# EAGLE design pcb-pick-plaz-feeder (EAGLE 9.6.2)
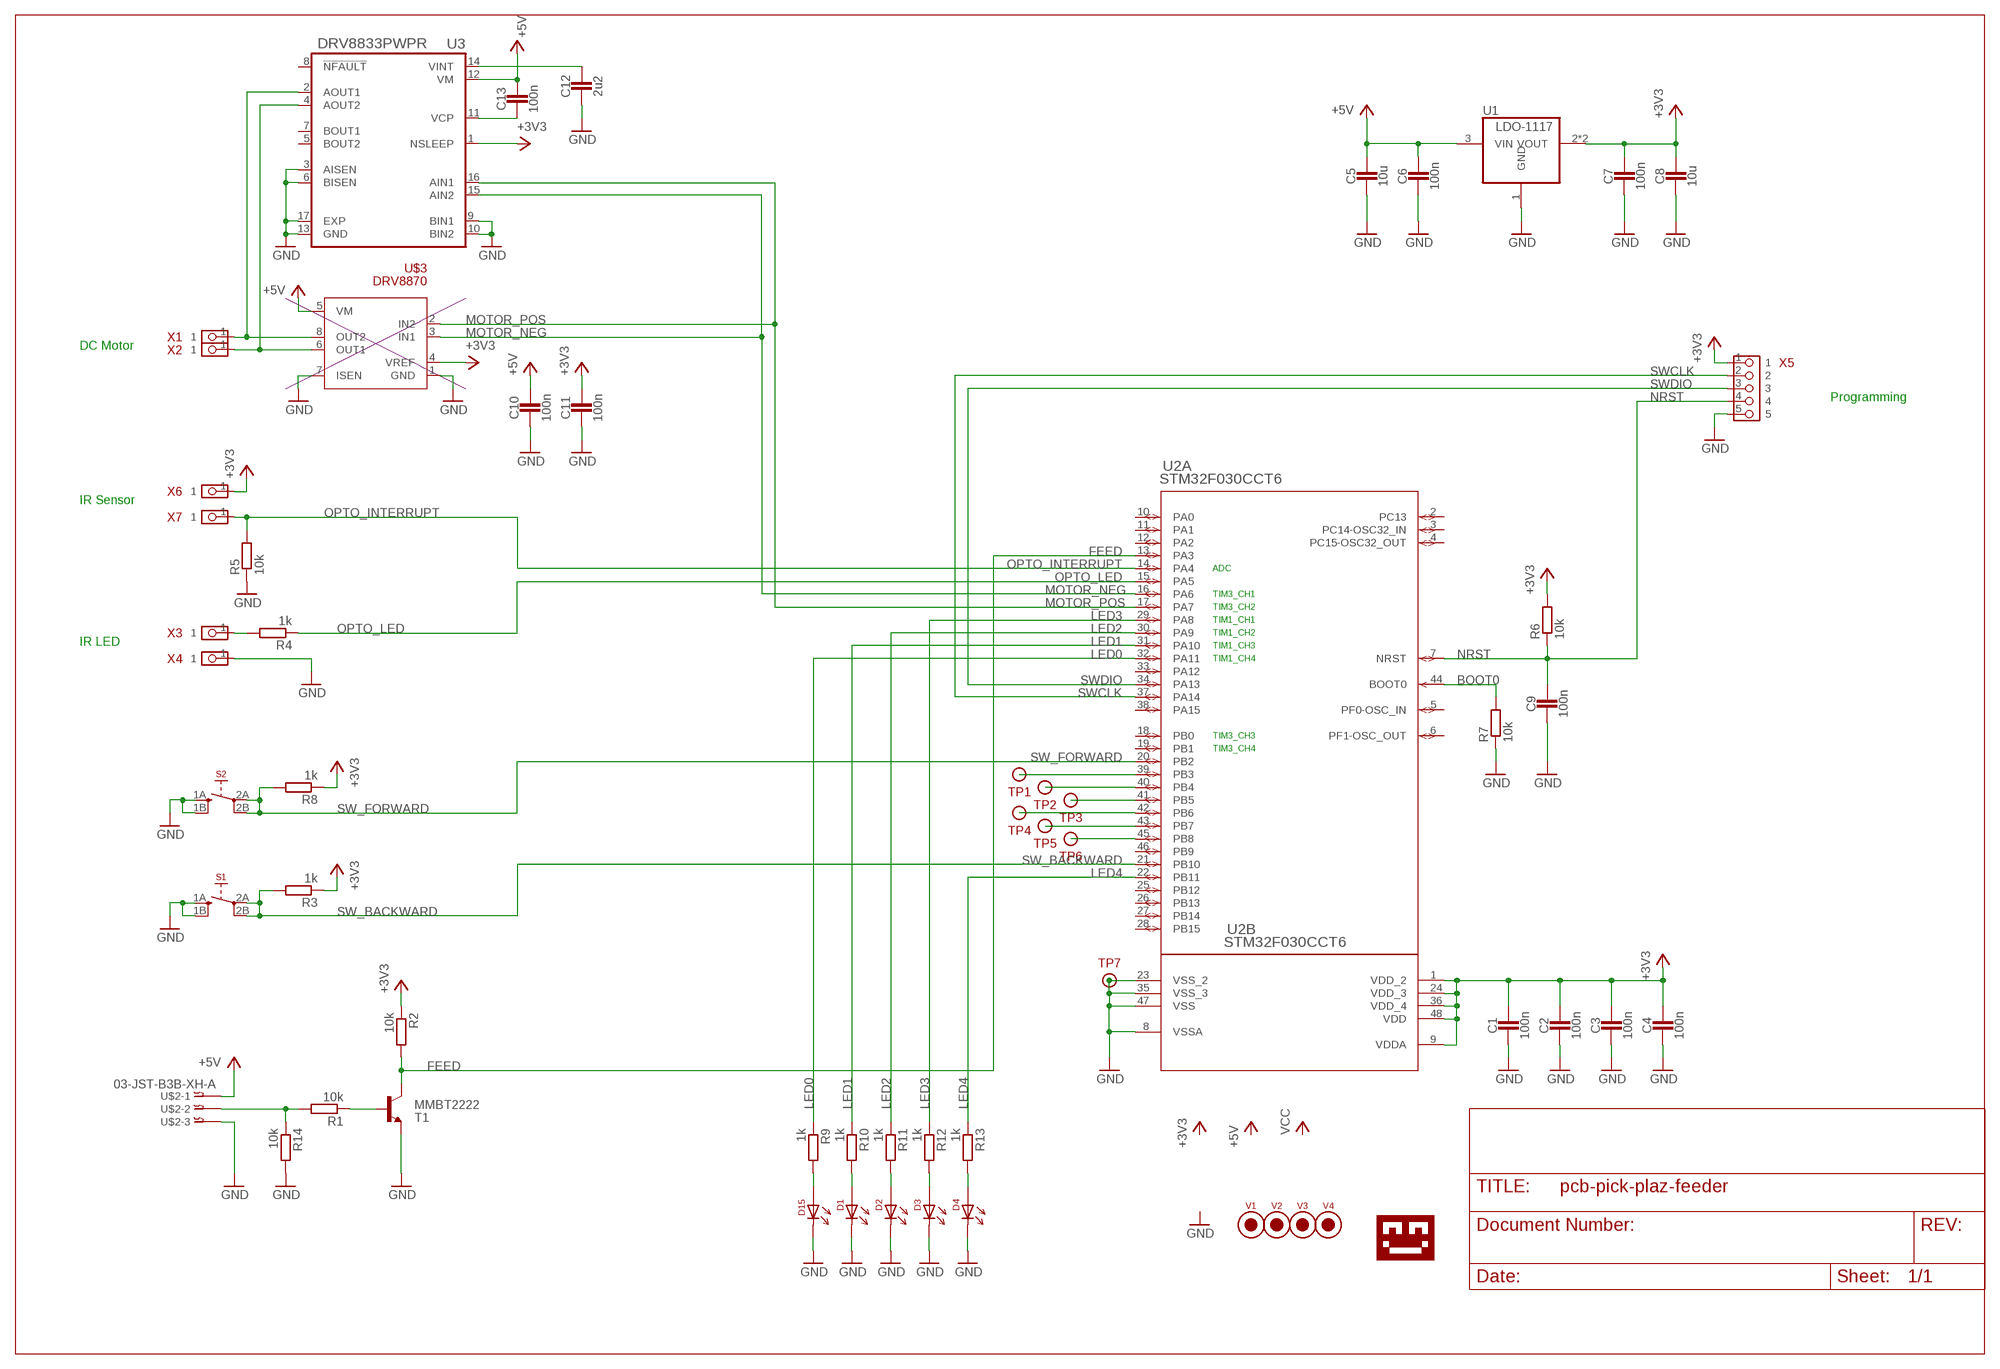
[diagram p0: schematic, sheet 1]

## Parts
C1  100n  CAPACITOR0603_CAP  [0603_CAP]
C2  100n  CAPACITOR0603_CAP  [0603_CAP]
C3  100n  CAPACITOR0603_CAP  [0603_CAP]
C4  100n  CAPACITOR0603_CAP  [0603_CAP]
C5  10u  CAPACITOR0805_CAP  [0805_CAP]
C6  100n  CAPACITOR0603_CAP  [0603_CAP]
C7  100n  CAPACITOR0603_CAP  [0603_CAP]
C8  10u  CAPACITOR0805_CAP  [0805_CAP]
C9  100n  CAPACITOR0603_CAP  [0603_CAP]
C10  100n  CAPACITOR0603_CAP  [0603_CAP]
C11  100n  CAPACITOR0603_CAP  [0603_CAP]
C12  2u2  CAPACITOR0805_CAP  [0805_CAP]
C13  100n  CAPACITOR0603_CAP  [0603_CAP]
D1  LED-0805  [0805-DOT]
D2  LED-0805  [0805-DOT]
D3  LED-0805  [0805-DOT]
D4  LED-0805  [0805-DOT]
D15  LED-0805  [0805-DOT]
R1  10k  RESISTOR0603_RES  [0603-RES]
R2  10k  RESISTOR0603_RES  [0603-RES]
R3  1k  RESISTOR0603_RES  [0603-RES]
R4  1k  RESISTOR0603_RES  [0603-RES]
R5  10k  RESISTOR0603_RES  [0603-RES]
R6  10k  RESISTOR0603_RES  [0603-RES]
R7  10k  RESISTOR0603_RES  [0603-RES]
R8  1k  RESISTOR0603_RES  [0603-RES]
R9  1k  RESISTOR0603_RES  [0603-RES]
R10  1k  RESISTOR0603_RES  [0603-RES]
R11  1k  RESISTOR0603_RES  [0603-RES]
R12  1k  RESISTOR0603_RES  [0603-RES]
R13  1k  RESISTOR0603_RES  [0603-RES]
R14  10k  RESISTOR0603_RES  [0603-RES]
S1  SWITCH_2PD  [SWITCH_WH]
S2  SWITCH_2PD  [SWITCH_WH]
T1  MMBT2222  MMBT2222ALT1-NPN-SOT23-BEC  [SOT23-BEC]
TP1  TESTPIN  [PIN-SMD-1X1-TEST_1M5]
TP2  TESTPIN  [PIN-SMD-1X1-TEST_1M5]
TP3  TESTPIN  [PIN-SMD-1X1-TEST_1M5]
TP4  TESTPIN  [PIN-SMD-1X1-TEST_1M5]
TP5  TESTPIN  [PIN-SMD-1X1-TEST_1M5]
TP6  TESTPIN  [PIN-SMD-1X1-TEST_1M5]
TP7  TESTPIN  [PIN-SMD-1X1-TEST_1M5]
U1  LDO-1117  [SOT-89]
U2  STM32F030CCT6  [LQFP48-7X7MM]
U3  DRV8833PWPR  [IC_DRV8833PWPR]
U$1  LOGO-TOBENG-1MM-FINISH  [TOBENG-1MM-FINISH]
U$2  03-JST-B3B-XH-A  [B3B-XH]
U$3  DRV8870  [SOIC-8]
V1  FIDUCIAL2MM  [FIDUCIAL_2MM]
V2  FIDUCIAL2MM  [FIDUCIAL_2MM]
V3  FIDUCIAL2MM  [FIDUCIAL_2MM]
V4  FIDUCIAL2MM  [FIDUCIAL_2MM]
X1  PIN_1X1SMD_BIG_L  [PIN_1X1_SMD_BIG_L]
X2  PIN_1X1SMD_BIG_L  [PIN_1X1_SMD_BIG_L]
X3  PIN_1X1SMD_BIG_L  [PIN_1X1_SMD_BIG_L]
X4  PIN_1X1SMD_BIG_L  [PIN_1X1_SMD_BIG_L]
X5  PIN_5X1HD  [PIN_5X1_HD]
X6  PIN_1X1SMD_BIG_L  [PIN_1X1_SMD_BIG_L]
X7  PIN_1X1SMD_BIG_L  [PIN_1X1_SMD_BIG_L]

## Nets
+3V3: C1.1 C2.1 C3.1 C4.1 C7.1 C8.P$1 C11.1 R2.1 R3.1 R6.2 R8.1 U1.2(VOUT) U1.2@1(VOUT) U2.1(B:VDD_2) U2.9(B:VDDA) U2.24(B:VDD_3) U2.36(B:VDD_4) U2.48(B:VDD) U3.1(NSLEEP) U$3.4(VREF) X5.1 X6.1
+5V: C5.P$1 C6.1 C10.1 C13.1 U1.3(VIN) U3.12(VM) U$2.P$1 U$3.5(VM)
BOOT0: R7.2 U2.44(A:BOOT0)
FEED: R2.2 T1.C U2.13(A:PA3)
GND: C1.2 C2.2 C3.2 C4.2 C5.P$2 C6.2 C7.2 C8.P$2 C9.2 C10.2 C11.2 C12.P$2 D1.2 D2.2 D3.2 D4.2 D15.2 R5.1 R7.1 R14.2 S1.1A S1.1B S2.1A S2.1B T1.E TP7.1 U1.1(GND) U2.8(B:VSSA) U2.23(B:VSS_2) U2.35(B:VSS_3) U2.47(B:VSS) U3.3(AISEN) U3.6(BISEN) U3.9(BIN1) U3.10(BIN2) U3.13(GND) U3.17(EXP) U$2.P$3 U$3.1(GND) U$3.7(ISEN) X4.1 X5.5
LED0: R9.1 U2.32(A:PA11)
LED1: R10.1 U2.31(A:PA10)
LED2: R11.1 U2.30(A:PA9)
LED3: R12.1 U2.29(A:PA8)
LED4: R13.1 U2.22(A:PB11)
MOTOR_NEG: U2.16(A:PA6) U3.15(AIN2) U$3.3(IN1)
MOTOR_POS: U2.17(A:PA7) U3.16(AIN1) U$3.2(IN2)
N$1: U3.4(AOUT2) U$3.6(OUT1) X2.1
N$2: U3.2(AOUT1) U$3.8(OUT2) X1.1
N$3: R1.2 R14.1 U$2.P$2
N$4: R1.1 T1.B
N$5: R4.2 X3.1
N$6: D15.1 R9.2
N$7: D1.1 R10.2
N$8: D2.1 R11.2
N$9: D3.1 R12.2
N$10: D4.1 R13.2
N$11: TP1.1 U2.39(A:PB3)
N$12: TP2.1 U2.40(A:PB4)
N$13: TP3.1 U2.41(A:PB5)
N$14: TP4.1 U2.42(A:PB6)
N$15: TP5.1 U2.43(A:PB7)
N$16: TP6.1 U2.45(A:PB8)
N$17: C12.P$1 U3.14(VINT)
N$18: C13.2 U3.11(VCP)
NRST: C9.1 R6.1 U2.7(A:NRST) X5.4
OPTO_INTERRUPT: R5.2 U2.14(A:PA4) X7.1
OPTO_LED: R4.1 U2.15(A:PA5)
SW_BACKWARD: R3.2 S1.2A S1.2B U2.21(A:PB10)
SW_FORWARD: R8.2 S2.2A S2.2B U2.20(A:PB2)
SWCLK: U2.37(A:PA14) X5.2
SWDIO: U2.34(A:PA13) X5.3
Unconnected: U2.2(A:PC13) U2.3(A:PC14-OSC32_IN) U2.4(A:PC15-OSC32_OUT) U2.5(A:PF0-OSC_IN) U2.6(A:PF1-OSC_OUT) U2.10(A:PA0) U2.11(A:PA1) U2.12(A:PA2) U2.18(A:PB0) U2.19(A:PB1) U2.25(A:PB12) U2.26(A:PB13) U2.27(A:PB14) U2.28(A:PB15) U2.33(A:PA12) U2.38(A:PA15) U2.46(A:PB9) U3.5(BOUT2) U3.7(BOUT1) U3.8(!NFAULT)

## Notes on the sheet
- DC Motor
- Programming
- IR Sensor
- ADC
- TIM3_CH1
- TIM3_CH2
- TIM1_CH1
- TIM1_CH2
- IR LED | TIM1_CH3
- TIM1_CH4
- TIM3_CH3
- TIM3_CH4

## Library data of the parts
C1-C13 = passives:CAPACITOR: SMD Capacitor
D1-D4 D15 = ftobler:LED
R1-R14 = passives:RESISTOR: Resistor Basic schematic elements and footprints for 0201, 0402, 0603, 1206, and PTH resistors.
S1 S2 = ftobler:SWITCH_2PD
T1 = transistor:*-NPN-: NPN Transistror BF959 corrected 2008.03.06
TP1-TP7 = ftobler:TESTPIN
U1 = ftobler:LDO
U2 = stm32:STM32F030CCT6; BUILT_BY: EMA_Jessica; COPYRIGHT: Copyright (C) 2018 Accelerated Designs. All rights reserved; MANUFACTURER_PART_NUMBER: STM32F030CCT6; SOURCELIBRARY: STMicroelectronics_2020-10-07; VENDOR: STMicroelectronics
U3 = DRV8833PWPR:DRV8833PWPR: 10.8-V, 2-A dual H-bridge motor driver with current regulation 16-HTSSOP -40 to 85 Check availability <https://pricing.snapeda.com/parts/DRV8833PWPR/Texas%20Instruments/view-part?ref=eda>; AVAILABILITY: In Stock; DESCRIPTION: 10.8-V, 2-A dual H-bridge motor driver with current regulation; MF: Texas Instruments; MP: DRV8833PWPR; PACKAGE: HTSSOP-16 Texas Instruments; PRICE: None; PURCHASE-URL: https://pricing.snapeda.com/search/part/DRV8833PWPR/?ref=eda
U$1 = ftobler:LOGO
U$2 = bt_con-jst-xh:03-JST: JST CONNECTOR
U$3 = ftobler:DRV8870
V1-V4 = ftobler:FIDUCIAL
X1-X4 X6 X7 = ftobler-conn:PIN_1X1
X5 = ftobler-conn:PIN_5X1

## Board
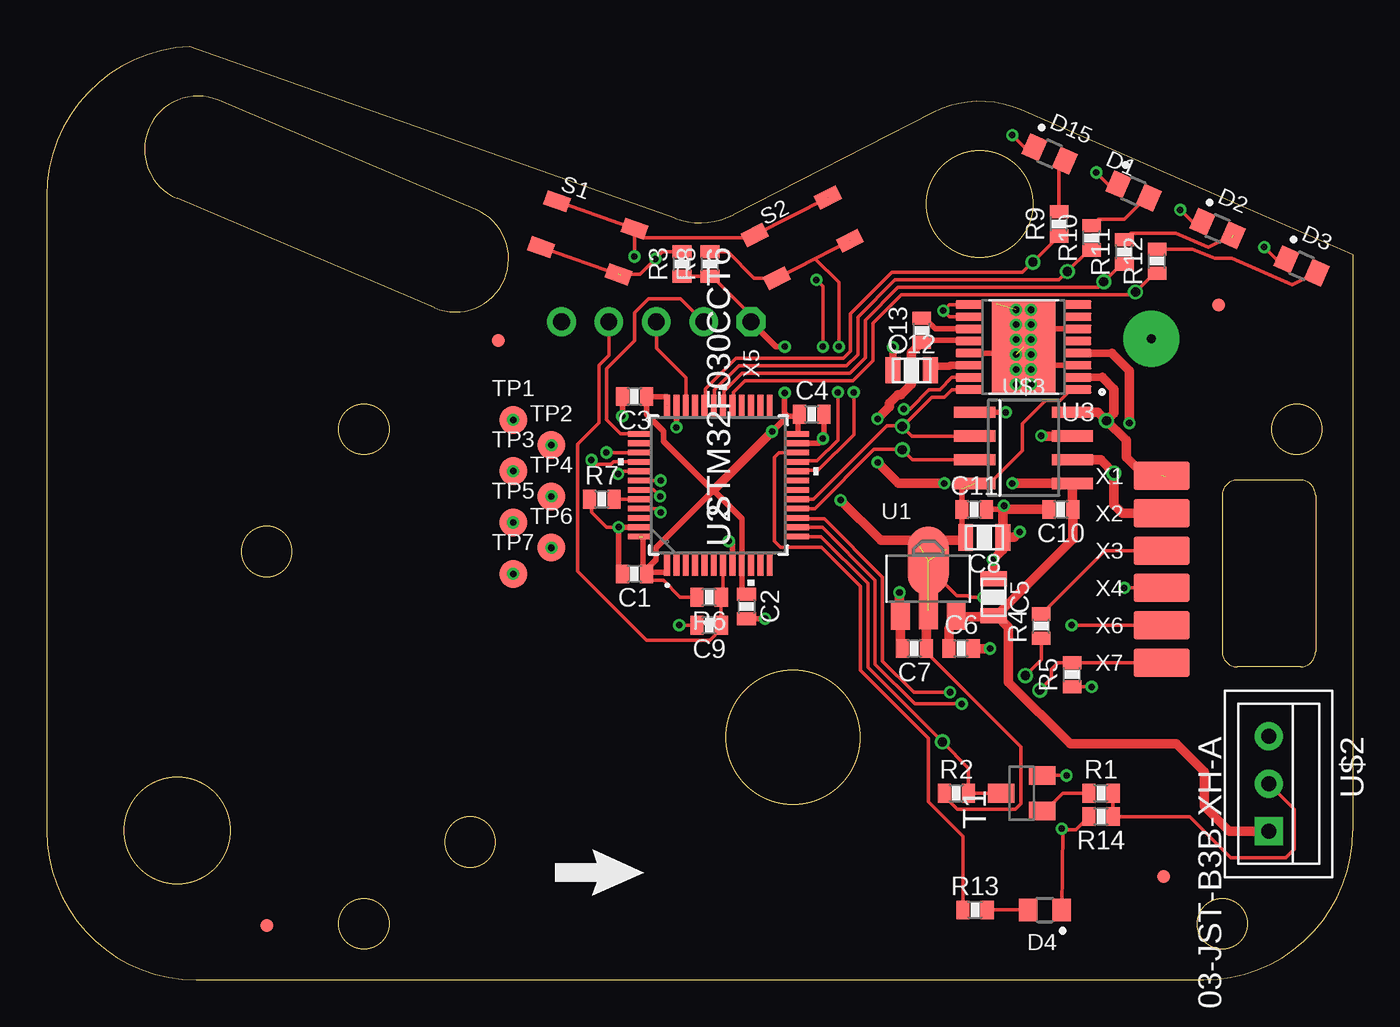
[diagram p1: board, top side]
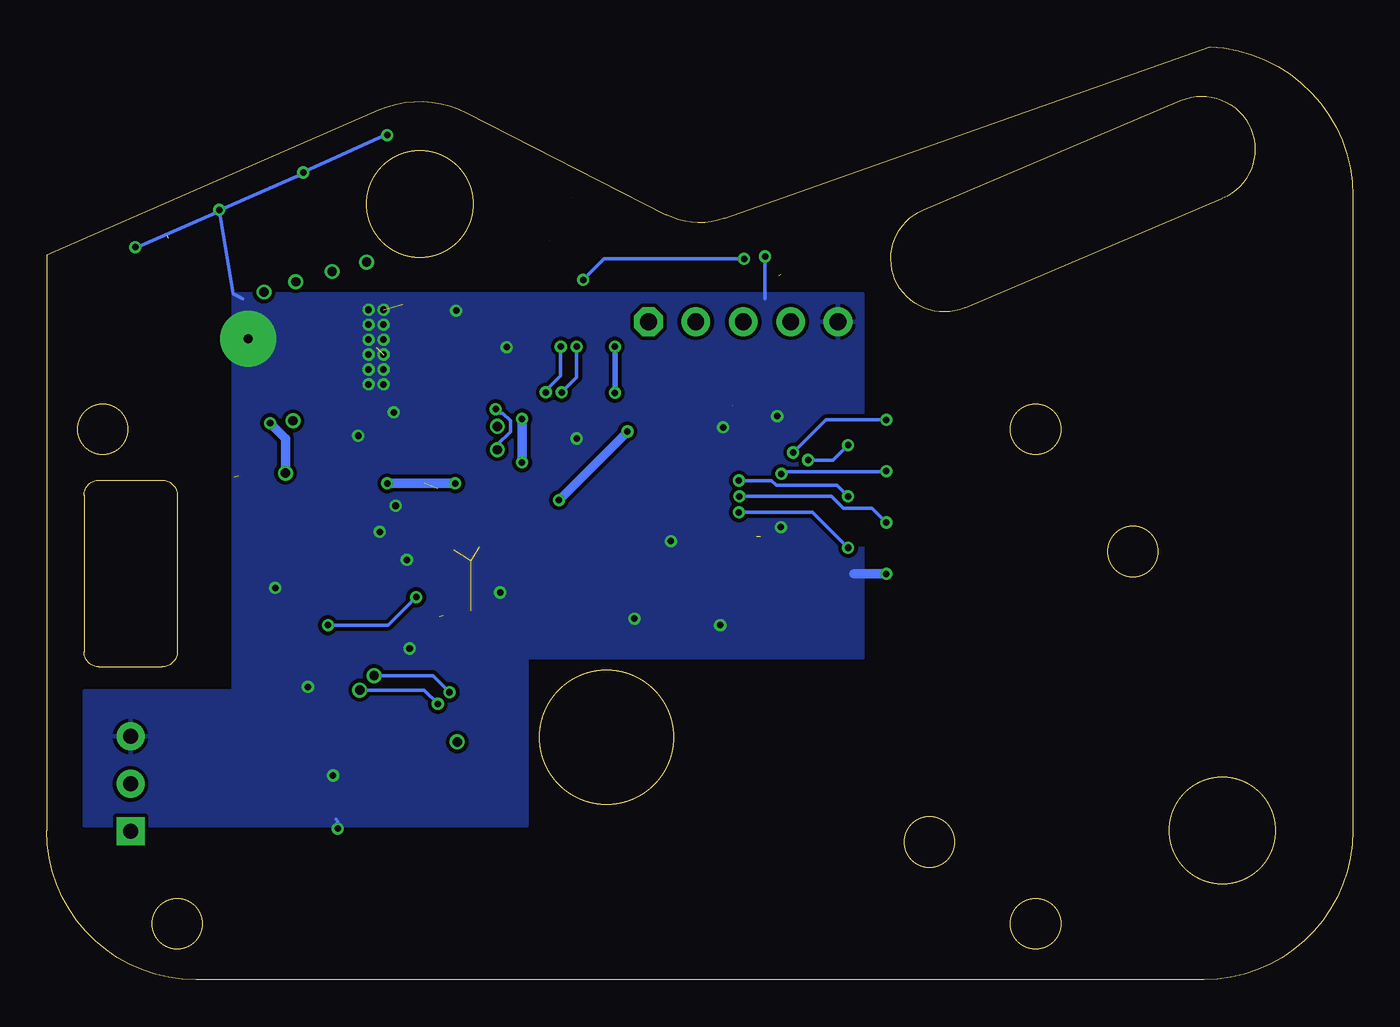
[diagram p2: board, bottom side, seen from below]

Size 70 x 49.99 mm. Coordinates in mm from the lower left corner, seen from the top.
Outline: 9.21,47.12 arc180 6.98,41.87 20.79,36.01 arc180 23.02,41.25 9.21,47.12
Outline: 8,0 62,0 arc90 70,8 70,38.85 52.2,46.6 arc51 47.5,46.46 36.82,41 arc-47 33.67,40.79 7.66,49.99 arc88 0,42 0,8 arc90 8,0
Outline: 67.2,26.77 63.8,26.77 arc90 63,25.97 63,17.57 arc90 63.8,16.77 67.2,16.77 arc90 68,17.57 68,25.97 arc90 67.2,26.77
Outline: circle at 17,29.5 radius 1.35
Outline: circle at 67,29.5 radius 1.35
Outline: circle at 63,3 radius 1.35
Outline: circle at 17,3 radius 1.35
Outline: circle at 40,13 radius 3.6
Outline: circle at 50,41.56 radius 2.85
Outline: circle at 7,8 radius 2.85
Outline: circle at 11.79,22.95 radius 1.35
Outline: circle at 22.69,7.39 radius 1.35
Copper layers (1*16): Top 0.035mm / dielectric 1.5mm / Bottom 0.035mm
Design rules "default *": minimum track width 0.2mm, minimum drill 0.3mm, track to track 0.2mm, track to pad 0.2mm, pad to pad 0.2mm, via to via 0.2mm, smd to smd 0.2mm, copper to edge 0.3mm, drill to drill 10mil, minimum pad ring 0.15mm, minimum via ring 0.15mm, stop-mask expansion 0.05mm, vias tented up to drill 0.35mm, thermal gap 0.2mm
bRestrict: 1 lines

### Footprints (pad centres in the part's own frame; a part is rotated, then mirrored left to right if it is on the bottom)
0603_CAP = smd 0.7 x 1: 1 -0.65,0; 2 0.65,0
0805_CAP = smd 0.8 x 1.4: P$1 1,0; P$2 -1,0
0805-DOT = smd 1 x 1.2: 1 0.9,0; 2 -0.9,0
0603-RES = smd 0.7 x 1: 1 -0.65,0; 2 0.65,0
SWITCH_WH = smd 1.3 x 0.8: 1A -2.2,1.3; 1B 2.2,1.3; 2A -2.2,-1.3; 2B 2.2,-1.3
SOT23-BEC = smd 1 x 1.4: B -0.95,-1.1; C 0,1.1; E 0.95,-1.1
PIN-SMD-1X1-TEST_1M5 = smd 1.5 x 1.5: 1 0,0
SOT-89 = smd 1 x 1.5: 1 -1.499,-1.981; 3 1.499,-1.981 | smd 1 x 2: 2 0,-1.727 | smd 2.2 x 3.7: 2@1 0,0.94
LQFP48-7X7MM = smd 1.194 x 0.305: 1 -4.25,2.75; 2 -4.25,2.25; 3 -4.25,1.75; 4 -4.25,1.25; 5 -4.25,0.75; 6 -4.25,0.25; 7 -4.25,-0.25; 8 -4.25,-0.75; 9 -4.25,-1.25; 10 -4.25,-1.75; 11 -4.25,-2.25; 12 -4.25,-2.75; 25 4.25,-2.75; 26 4.25,-2.25; 27 4.25,-1.75; 28 4.25,-1.25; 29 4.25,-0.75; 30 4.25,-0.25; 31 4.25,0.25; 32 4.25,0.75; 33 4.25,1.25; 34 4.25,1.75; 35 4.25,2.25; 36 4.25,2.75 | smd 0.305 x 1.194: 13 -2.75,-4.25; 14 -2.25,-4.25; 15 -1.75,-4.25; 16 -1.25,-4.25; 17 -0.75,-4.25; 18 -0.25,-4.25; 19 0.25,-4.25; 20 0.75,-4.25; 21 1.25,-4.25; 22 1.75,-4.25; 23 2.25,-4.25; 24 2.75,-4.25; 37 2.75,4.25; 38 2.25,4.25; 39 1.75,4.25; 40 1.25,4.25; 41 0.75,4.25; 42 0.25,4.25; 43 -0.25,4.25; 44 -0.75,4.25; 45 -1.25,4.25; 46 -1.75,4.25; 47 -2.25,4.25; 48 -2.75,4.25
IC_DRV8833PWPR = smd 1.5 x 0.45: 1 -2.9,2.275; 2 -2.9,1.625; 3 -2.9,0.975; 4 -2.9,0.325; 5 -2.9,-0.325; 6 -2.9,-0.975; 7 -2.9,-1.625; 8 -2.9,-2.275; 9 2.9,-2.275; 10 2.9,-1.625; 11 2.9,-0.975; 12 2.9,-0.325; 13 2.9,0.325; 14 2.9,0.975; 15 2.9,1.625; 16 2.9,2.275 | smd 3.4 x 5: 17 0,0
B3B-XH = drill 0.8 pad 1.5 square: P$1 2.54,0 | drill 0.8 pad 1.5: P$2 0,0; P$3 -2.54,0
SOIC-8 = smd 0.61 x 2.21: 1 -1.905,-2.616; 2 -0.635,-2.616; 3 0.635,-2.616; 4 1.905,-2.616; 5 1.905,2.616; 6 0.635,2.616; 7 -0.635,2.616; 8 -1.905,2.616
FIDUCIAL_2MM = smd 0.7 x 0.7: V 0,0
PIN_1X1_SMD_BIG_L = smd 3 x 1.54: 1 0,0
PIN_5X1_HD = drill 0.9 pad 1.54 octagon: 1 0,0 | drill 0.9 pad 1.54: 2 0,-2.54; 3 0,-5.08; 4 0,-7.62; 5 0,-10.16

### Placement (x,y rotation side)
C1  31.5,21.75 180 top
C2  37.5,20 270 top
C3  31.5,31.25 180 top
C4  41,30.3 0 top
C5  50.75,20.5 270 top
C6  49,17.75 0 top
C7  46.5,17.75 180 top
C8  50.25,23.7 180 top
C9  35.5,19 180 top
C10  54.35,25.2 180 top
C11  49.7,25.2 0 top
C12  46.35,32.65 0 top
C13  46.9,34.8 90 top
D1  58.25,42.25 336.4 top
D2  62.75,40.25 336.4 top
D3  67.25,38.25 336.4 top
D4  53.5,3.75 180 top
D15  53.75,44.25 336.4 top
R1  56.5,10 0 top
R2  48.75,10 0 top
R3  34.05,38.35 90 top
R4  53.3,18.95 90 top
R5  54.95,16.35 90 top
R6  35.5,20.5 180 top
R7  29.75,25.75 0 top
R8  35.55,38.35 90 top
R9  54.25,40.5 90 top
R10  56,39.75 90 top
R11  57.75,39 90 top
R12  59.5,38.5 90 top
R13  49.75,3.75 0 top
R14  56.5,8.75 180 top
S1  29,39.75 340.5 top
S2  40.5,39.75 27.1 top
T1  52.25,10 90 top
TP1  25,30 0 top
TP2  27.05,28.65 0 top
TP3  25,27.25 0 top
TP4  27.05,25.9 0 top
TP5  25,24.5 0 top
TP6  27.05,23.15 0 top
TP7  25,21.75 0 top
U1  47.25,21.5 0 top
U2  36,26.5 90 top
U3  52.35,33.9 180 top
U$1  15.65,10.65 0 top
U$2  65.5,10.5 270 top
U$3  52.35,28.5 270 top
V1  59.85,5.55 0 top
V2  62.8,36.15 0 top
V3  24.2,34.25 0 top
V4  11.8,2.9 0 top
X1  59.75,27 180 top
X2  59.75,25 180 top
X3  59.75,23 180 top
X4  59.75,21 180 top
X5  37.75,35.25 270 top
X6  59.75,19 180 top
X7  59.75,17 180 top

### Tracks (layer width: path | path; a pad name or v marks a point on that pad's centre or on a via)
+3V3  (via drill 0.35)  (6 unrouted)
  Top 0.2: R2.1 48.1,9.85 48.8,9.15 51.92,9.15 52.2,9.43 52.2,12.5 47.15,17.55 C7.1 | 48.2,23.05 47.25,22.1 48.78,20.57 49.37,20.57 49.44,20.5 v50.2,20.5 | X6.1 v54.92,19 | R6.2 33.95,20.5 33.05,21.4 32.3,21.4 32.15,21.55 C1.1 | U2.1 33.25,21.85 | R3.1 R8.1 35.65,37.7 37.75,35.6 X5.1 | U3.1 54.9,31.62 54.33,31.05 53.55,31.05 52.3,29.8 52.3,28.35 50.55,26.59 U$3.4
  Top 0.3: U2.36 33.25,31.25 C3.1 32.15,30.3 33.05,29.4 33.05,28.85 35.67,26.23 35.73,26.23 | C1.1 32.15,21.85 33.25,21.85 | C1.1 31.95,21.95 31.95,23.75 | U2.24 40.25,30.2 | 40.25,30.2 C4.1 | C8.P$1 49.05,23.9 C11.1 49.05,26.3 | C2.1 37.45,20.6 37.3,20.6 37.25,20.65 U2.9 37.25,24.7 35.73,26.23 | C1.1 32.15,22 32.65,22.5 32.65,23.15 35.73,26.23 | 39.7,30.2 v38.88,29.38 | 39.7,30.2 40.25,30.2 | X5.1 39.08,33.92 v39.55,33.92 | v39.55,31.45 39.55,30.35 39.7,30.2
  Top 0.5: C7.1 47.15,19.35 47.25,19.45 U1.2 | C8.P$1 49.15,23.7 49,23.55 47.15,23.55 46.8,23.2 | v38.88,29.38 35.73,26.23 | v42.55,25.7 44.7,23.55 46.74,23.55 47.25,23.04 U1.2@1
  Bottom 0.2: v54.92,19 51.7,19 v50.2,20.5
  Bottom 0.3: v39.55,33.92 v39.55,31.45
  Bottom 0.5: v42.55,25.7 v38.88,29.38
+5V  (via drill 0.35)  (1 unrouted)
  Top 0.3: U3.12 49.4,34.27 47.02,34.27 C13.1
  Top 0.5: C6.1 48.35,18.8 48.75,19.2 U1.3 | C5.P$1 50.7,19.45 48.95,19.45 | C5.P$1 50.95,19.5 51.55,18.9 51.55,15.95 54.85,12.65 60.55,12.65 62.05,11.15 62.05,9.3 63.39,7.96 U$2.P$1 | C5.P$1 50.9,19.5 55,23.6 C10.1 54.97,25.23 U$3.5 v51.75,26.6 | C13.1 46.35,33.6 46.35,31.91 45.79,31.35 45.62,31.35 45.16,30.9 45.16,30.7 v44.52,30.06 | v44.52,27.73 45.65,26.6 v48.1,26.6
  Bottom 0.5: v44.52,30.06 v44.52,27.73 | v44.52,27.73 | v48.1,26.6 v51.75,26.6
BOOT0
  Top 0.2: R7.2 U2.44
FEED  (via drill 0.5)
  Top 0.2: T1.C R2.2 49.4,11.35 v48,12.75 44,16.75 44,21.25 41.5,23.75 U2.13
GND  (via drill 0.35, 0.5 pad 3)  (3 unrouted)
  Top 0.2: D1.2 56.87,42.63 v56.25,43.25 | D2.2 61.37,40.63 v60.75,41.25 | D3.2 65.87,38.63 v65.25,39.25 | D15.2 52.37,44.63 v51.75,45.25 | C9.2 v33.9,19 | T1.E v54.65,10.95 | D4.2 54.45,8.05 | 54.45,8.05 v54.4,8.1 | S1.1A S1.1B | S2.1B S2.1A 37.79,39.75 32,39.75 S1.1B | S1.1B v31.51,38.76 v31.5,38.75 | R14.2 55.15,8.05 54.45,8.05 | X4.1 v57.75,21 | R5.1 v56,15.7 | R7.1 29.2,25.65 29.2,25.05 30,24.25 v30.65,24.25 | 49.52,35.6 U3.10 48.38,35.52 v48.05,35.85 48.38,36.17 U3.9
  Top 0.3: C3.2 v30.85,30.2 | U2.35 v33.75,29.6 | U2.47 v30.65,24.25 30.65,21.95 C1.2 | R7.1 29.1,25.45 | C2.2 v38.5,19.35 | U2.8 36.75,23.3 v36.55,23.5 | U2.23 41.35,28.75 v41.6,29 41.65,29.05 C4.2 | v51.4,30.4 v51.39,30.41 U$3.1 | 51.25,25.35 v51.3,25.4 51.1,25.2 C11.2 | U3.13 52.02,33.58 U3.17 | U3.6 53.33,34.88 U3.17 | U3.3 53.33,32.92 U3.17
  Top 0.4: 49.76,33.58 U3.13 49.48,33.6 | v45.35,33.9 C12.P$2 | 50.91,36.17 50.93,36.2
  Top 0.5: U$3.7 53.31,29.14 v53.3,29.15 | C10.2 51.5,25.2 v51.3,25.4 | v52.15,24 51.85,23.7 C8.P$2 | C8.P$2 51.25,25.35 | v45.7,20.75 45.7,19.57 U1.1 45.75,17.85 C7.2 | C6.2 v50.55,17.75 | C5.P$2 50.7,21.55 v50.7,22.5 51.25,23.05 C8.P$2
  Bottom 0.2: v51.75,45.25 51.9,45.25 56.21,43.29 v56.25,43.25 56.34,43.16 60.68,41.25 v60.75,41.25 | v60.75,41.25 60.88,41.12 65.14,39.25 v65.25,39.25 | 59.5,36.5 60,36.75 v60.75,41.25 | v54.4,8.1 54.4,8.5 54.5,8.6 | v31.5,38.75 31.5,36.5
  Bottom 0.5: TP7.1 26.75,21.75
  other vias: 59.2,34.35 25,21.75 51.95,34.3 52.75,33.5 51.95,33.5 52.75,34.3 51.95,35.9 52.75,35.1 51.95,35.1 52.75,35.9 51.95,32.7 52.75,31.9 51.95,31.9 52.75,32.7
  pour Bottom: 26.25,36.75 26.25,17.25 44.25,17.25 44.25,8.25 68,8.25 68,15.5 60,15.5 60,36.75
LED0  (via drill 0.5)
  Top 0.2: U2.32 35.3,30.8 35.3,31.67 36.93,33.3 42.3,33.3 42.71,33.3 43.08,33.67 43.08,35.67 45.3,37.9 52.3,37.9 v52.85,38.45 R9.1
LED1  (via drill 0.5)
  Top 0.2: R10.1 55.85,39.1 v54.7,37.95 54.25,37.5 47.5,37.5 47.39,37.5 45.47,37.5 43.48,35.51 43.48,33.5 42.88,32.9 42.79,32.9 42.65,32.9 37.09,32.9 35.8,31.6 35.8,30.8 U2.31
LED2  (via drill 0.5)
  Top 0.2: R11.1 57.6,38.35 v56.65,37.4 56.35,37.1 45.63,37.1 43.88,35.34 43.88,33.34 43.04,32.5 37.26,32.5 36.3,31.54 36.3,30.8 U2.30
LED3  (via drill 0.5)
  Top 0.2: R12.1 59.35,37.85 v58.35,36.85 58.2,36.7 45.8,36.7 44.27,35.18 44.27,33.17 43.21,32.1 42.72,32.1 42.6,32.1 37.43,32.1 36.8,31.47 36.8,30.8 U2.29
LED4
  Top 0.2: U2.22 39.25,28.25 39,28 39,23.5 39.33,23.18 41.51,23.18 43.6,21.08 43.6,16.58 47.25,12.93 47.25,9.55 49.1,7.7 R13.1
MOTOR_NEG  (via drill 0.35, 0.5)
  Top 0.2: U2.16 41.17,25.25 44.33,28.41 45.85,28.41 v45.85,28.4 46.38,27.87 U$3.3 | U3.15 48.52,32.27 47.86,31.61 47.29,31.61 46.25,30.57 v45.94,30.57
  Bottom 0.2: v45.85,28.4 45.85,28.66 45.15,29.36 45.15,29.94 45.56,30.35 45.71,30.35 v45.94,30.57
MOTOR_POS  (via drill 0.5)
  Top 0.2: U2.17 41.1,25.75 45.03,29.68 45.85,29.68 v45.85,29.65 | v45.85,29.65 46.37,29.14 U$3.2 | U3.16 48.52,31.62 48.11,31.21 47.45,31.21 45.89,29.65 v45.85,29.65
N$1  (via drill 0.35, 0.5)
  Top 0.4: 57.08,33.58 U3.4
  Top 0.5: U$3.6 56.48,27.87 v57.2,27.15 57.2,25.45 57.65,25 X2.1 60.8,25 | v58.02,29.82 58.02,32.63 57.08,33.58
  Bottom 0.5: v57.2,27.15 57.2,29 v58.02,29.82
N$2  (via drill 0.5)  (1 unrouted)
  Top 0.4: U3.2 56.58,32.27
  Top 0.5: U$3.8 56.34,30.41 v56.8,29.95 | v56.8,29.95 57.85,28.9 57.85,28 58.9,26.95 59.95,26.95 | v56.8,29.95 57.2,30.35 57.2,31.65 56.58,32.27
N$3
  Top 0.2: R1.2 R14.1 61.25,8.75 63.45,6.55 66.4,6.55 66.85,7 66.85,9.15 U$2.P$2
N$4
  Top 0.2: T1.B 53.5,9.05 54.45,10 R1.1
N$5
  Top 0.2: R4.2 56.7,23 X3.1
N$6
  Top 0.2: R9.2 54.25,43.5 D15.1
N$7
  Top 0.2: R10.2 56.35,40.75 57.75,40.75 58.87,41.87 D1.1
N$8  (1 unrouted)
  Top 0.2: R11.2 58.1,40 60.5,40 62.25,39.25 D2.1 | 63.25,39.5 63.5,39.75
N$9
  Top 0.2: R12.2 61.4,39.15 62.6,38.65 63.5,38.65 66.75,37.25 D3.1
N$10
  Top 0.2: R13.2 D4.1
N$11  (via drill 0.35)
  Top 0.2: v30,28.25 U2.39
  Bottom 0.2: TP1.1 28.25,30 v30,28.25
  other vias: 25,30
N$12  (via drill 0.35)
  Top 0.2: U2.40 30.38,27.75 30.26,27.62 29.42,27.62 v29.2,27.85
  Bottom 0.2: v29.2,27.85 27.85,27.85 TP2.1
  other vias: 27.05,28.65
N$13  (via drill 0.35)
  Top 0.2: v30.63,27.11 30.77,27.25 U2.41
  Bottom 0.2: TP3.1 25.03,27.22 30.51,27.22 v30.63,27.11
  other vias: 25,27.25
N$14  (via drill 0.35)
  Top 0.2: U2.42 v32.9,26.75
  Bottom 0.2: v32.9,26.75 31.15,26.75 30.89,26.48 27.63,26.48 TP4.1
  other vias: 27.05,25.9
N$15  (via drill 0.35)
  Top 0.2: U2.43 32.52,26.25 v32.87,25.9
  Bottom 0.2: v32.87,25.9 27.93,25.9 27.31,25.27 25.77,25.27 TP5.1
  other vias: 25,24.5
N$16  (via drill 0.35)
  Top 0.2: U2.45 32.7,25.25 v32.9,25.05
  Bottom 0.2: v32.9,25.05 28.95,25.05 TP6.1
  other vias: 27.05,23.15
N$17
  Top 0.4: C12.P$1 47.35,32.88 48.38,32.88 48.42,32.92 U3.14
N$18
  Top 0.3: U3.11 47.62,34.88 47.05,35.45 C13.2
NRST
  Top 0.2: U2.7 36.25,20.6 R6.1 C9.1 36.15,18.8 35.55,18.2 32.15,18.2 28.45,21.9 28.45,28.68 29.6,29.83 29.6,32.92 30.13,33.45 X5.4
OPTO_INTERRUPT  (via drill 0.35, 0.5)
  Top 0.2: U2.14 41.57,24.25 44.4,21.42 44.4,16.92 46.53,14.78 v49.03,14.78 | v53.22,15.52 53.85,16.15 53.85,16.65 54.2,17 R5.2 X7.1
  Bottom 0.2: v49.03,14.78 49.77,15.52 v53.22,15.52
OPTO_LED  (via drill 0.35, 0.5)
  Top 0.2: U2.15 40.3,24.7 41.68,24.7 44.8,21.58 44.8,17.08 46.47,15.41 v48.41,15.41 | v52.45,16.3 53.3,17.15 R4.1
  Bottom 0.2: v48.41,15.41 49.3,16.3 v52.45,16.3
SW_BACKWARD  (via drill 0.35)  (1 unrouted)
  Top 0.2: U2.21 40.3,27.8 41.28,27.8 42.4,28.92 v42.4,31.48 | S1.2A 30.75,37.75 | S1.2B 31.79,37.79 v32.62,38.62 33,39 R3.2 | v41.25,37.5 41.6,37.15 v41.6,33.92
  Bottom 0.2: v41.6,33.92 41.6,32.27 v42.4,31.48 | v32.62,38.62 40.12,38.62 v41.25,37.5
SW_FORWARD  (via drill 0.35)  (1 unrouted)
  Top 0.2: U2.20 40.3,27.3 41.35,27.3 43.25,29.2 v43.25,31.48 | 41.18,38.64 S2.2A 37.91,37.59 36.5,39 R8.2 | 41.18,38.64 S2.2B | v42.45,33.92 42.45,37.37 41.18,38.64
  Bottom 0.2: v42.45,33.92 42.45,32.38 43.25,31.57 v43.25,31.48
SWCLK
  Top 0.2: U2.37 30.75,29.25 30,30 30,32.75 31.5,34.25 31.5,35.75 32.25,36.5 33.96,36.5 X5.2
SWDIO
  Top 0.2: U2.34 34.25,32.25 32.67,33.83 X5.3

### Text on the board
tStop: V2 | V3 | V1 | V4
tFinish: L1 | L2 | S1 | S2 | L3 | L4 | GND | NRST | SWDIO | SWCK | 3V3 | M+ | M- | LED+ | TP1 / TP2 / TP3 / TP4 / TP5 / TP6 / GND | LED- | TR+ | pcb-pick-plaz-feeder v1b / by ftobler 2022 | TR- | GND | FEED | VDD | L5